# Altium schematic sheet OECU_BASE3.SchDoc
size A4; SheetNumber: 3; SheetTotal: 6
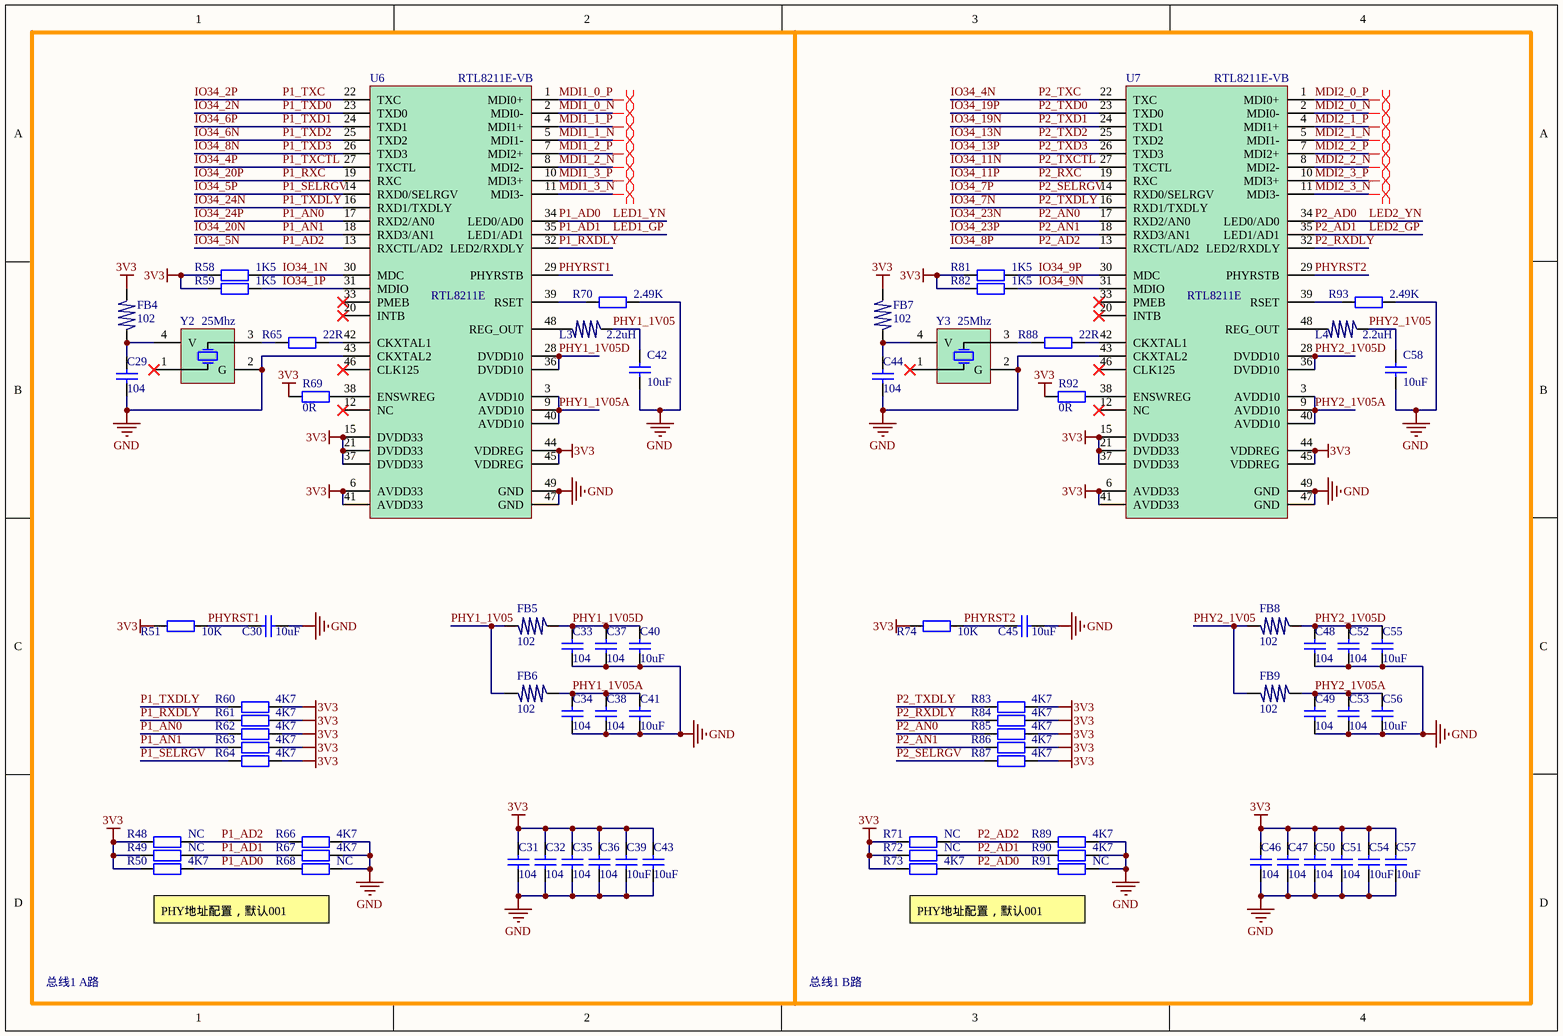
[diagram p0: OECU_BASE3.SchDoc]

## Parts
C29  104  [0402]
C30  10uF  [0402]
C31  104  [0402]
C32  104  [0402]
C33  104  [0402]
C34  104  [0402]
C35  104  [0402]
C36  104  [0402]
C37  104  [0402]
C38  104  [0402]
C39  10uF  [0402]
C40  10uF  [0402]
C41  10uF  [0402]
C42  10uF  [0402]
C43  10uF  [0402]
C44  104  [0402]
C45  10uF  [0402]
C46  104  [0402]
C47  104  [0402]
C48  104  [0402]
C49  104  [0402]
C50  104  [0402]
C51  104  [0402]
C52  104  [0402]
C53  104  [0402]
C54  10uF  [0402]
C55  10uF  [0402]
C56  10uF  [0402]
C57  10uF  [0402]
C58  10uF  [0402]
FB4  102  [0402]
FB5  102  [0603]
FB6  102  [0603]
FB7  102  [0402]
FB8  102  [0603]
FB9  102  [0603]
L3  2.2uH  [0805]
L4  2.2uH  [0805]
R48  NC  [R_0402]
R49  NC  [R_0402]
R50  4K7  [R_0402]
R51  10K  [R_0402]
R58  1K5  [R_0402]
R59  1K5  [R_0402]
R60  4K7  [R_0402]
R61  4K7  [R_0402]
R62  4K7  [R_0402]
R63  4K7  [R_0402]
R64  4K7  [R_0402]
R65  22R  [R_0402]
R66  4K7  [R_0402]
R67  4K7  [R_0402]
R68  NC  [R_0402]
R69  0R  [R_0402]
R70  2.49K  [R_0402]
R71  NC  [R_0402]
R72  NC  [R_0402]
R73  4K7  [R_0402]
R74  10K  [R_0402]
R81  1K5  [R_0402]
R82  1K5  [R_0402]
R83  4K7  [R_0402]
R84  4K7  [R_0402]
R85  4K7  [R_0402]
R86  4K7  [R_0402]
R87  4K7  [R_0402]
R88  22R  [R_0402]
R89  4K7  [R_0402]
R90  4K7  [R_0402]
R91  NC  [R_0402]
R92  0R  [R_0402]
R93  2.49K  [R_0402]
U6  RTL8211E-VB  [QFN48]
U7  RTL8211E-VB  [QFN48]
Y2  25Mhz  [XTAL_3225]
Y3  25Mhz  [XTAL_3225]

## Nets
3V3: C31.1 C32.1 C35.1 C36.1 C39.1 C43.1 C46.1 C47.1 C50.1 C51.1 C54.1 C57.1 FB4.2 FB7.2 R48.1 R49.1 R50.1 R51.1 R58.2 R59.2 R60.2 R61.2 R62.2 R63.2 R64.2 R69.2 R71.1 R72.1 R73.1 R74.1 R81.2 R82.2 R83.2 R84.2 R85.2 R86.2 R87.2 R92.2 U6.6(AVDD33) U6.15(DVDD33) U6.21(DVDD33) U6.37(DVDD33) U6.41(AVDD33) U6.44(VDDREG) U6.45(VDDREG) U7.6(AVDD33) U7.15(DVDD33) U7.21(DVDD33) U7.37(DVDD33) U7.41(AVDD33) U7.44(VDDREG) U7.45(VDDREG)
GND: C29.1 C30.2 C31.2 C32.2 C33.1 C34.1 C35.2 C36.2 C37.1 C38.1 C39.2 C40.1 C41.1 C42.1 C43.2 C44.1 C45.2 C46.2 C47.2 C48.1 C49.1 C50.2 C51.2 C52.1 C53.1 C54.2 C55.1 C56.1 C57.2 C58.1 R66.2 R67.2 R68.2 R70.2 R89.2 R90.2 R91.2 R93.2 U6.43(CKXTAL2) U6.47(GND) U6.49(GND) U7.43(CKXTAL2) U7.47(GND) U7.49(GND) Y2.2(G) Y3.2(G)
IO34_1N: R58.1 U6.30(MDC)
IO34_1P: R59.1 U6.31(MDIO)
IO34_2N: U6.23(TXD0)  [also labelled P1_TXD0]
IO34_2P: U6.22(TXC)  [also labelled P1_TXC]
IO34_4N: U7.22(TXC)  [also labelled P2_TXC]
IO34_4P: U6.27(TXCTL)  [also labelled P1_TXCTL]
IO34_5N: R48.2 R66.1 U6.13(RXCTL/AD2)  [also labelled P1_AD2]
IO34_5P: R64.1 U6.14(RXD0/SELRGV)  [also labelled P1_SELRGV]
IO34_6N: U6.25(TXD2)  [also labelled P1_TXD2]
IO34_6P: U6.24(TXD1)  [also labelled P1_TXD1]
IO34_7N: R83.1 U7.16(RXD1/TXDLY)  [also labelled P2_TXDLY]
IO34_7P: R87.1 U7.14(RXD0/SELRGV)  [also labelled P2_SELRGV]
IO34_8N: U6.26(TXD3)  [also labelled P1_TXD3]
IO34_8P: R71.2 R89.1 U7.13(RXCTL/AD2)  [also labelled P2_AD2]
IO34_9N: R82.1 U7.31(MDIO)
IO34_9P: R81.1 U7.30(MDC)
IO34_11N: U7.27(TXCTL)  [also labelled P2_TXCTL]
IO34_11P: U7.19(RXC)  [also labelled P2_RXC]
IO34_13N: U7.25(TXD2)  [also labelled P2_TXD2]
IO34_13P: U7.26(TXD3)  [also labelled P2_TXD3]
IO34_19N: U7.24(TXD1)  [also labelled P2_TXD1]
IO34_19P: U7.23(TXD0)  [also labelled P2_TXD0]
IO34_20N: R63.1 U6.18(RXD3/AN1)  [also labelled P1_AN1]
IO34_20P: U6.19(RXC)  [also labelled P1_RXC]
IO34_23N: R85.1 U7.17(RXD2/AN0)  [also labelled P2_AN0]
IO34_23P: R86.1 U7.18(RXD3/AN1)  [also labelled P2_AN1]
IO34_24N: R60.1 U6.16(RXD1/TXDLY)  [also labelled P1_TXDLY]
IO34_24P: R62.1 U6.17(RXD2/AN0)  [also labelled P1_AN0]
LED1_GP: R49.2 R67.1 U6.35(LED1/AD1)  [also labelled P1_AD1]
LED1_YN: R50.2 R68.1 U6.34(LED0/AD0)  [also labelled P1_AD0]
LED2_GP: R72.2 R90.1 U7.35(LED1/AD1)  [also labelled P2_AD1]
LED2_YN: R73.2 R91.1 U7.34(LED0/AD0)  [also labelled P2_AD0]
MDI1_0_N: U6.2(MDI0-)
MDI1_0_P: U6.1(MDI0+)
MDI1_1_N: U6.5(MDI1-)
MDI1_1_P: U6.4(MDI1+)
MDI1_2_N: U6.8(MDI2-)
MDI1_2_P: U6.7(MDI2+)
MDI1_3_N: U6.11(MDI3-)
MDI1_3_P: U6.10(MDI3+)
MDI2_0_N: U7.2(MDI0-)
MDI2_0_P: U7.1(MDI0+)
MDI2_1_N: U7.5(MDI1-)
MDI2_1_P: U7.4(MDI1+)
MDI2_2_N: U7.8(MDI2-)
MDI2_2_P: U7.7(MDI2+)
MDI2_3_N: U7.11(MDI3-)
MDI2_3_P: U7.10(MDI3+)
P1_RXDLY: R61.1 U6.32(LED2/RXDLY)
P2_RXDLY: R84.1 U7.32(LED2/RXDLY)
PHY1_1V05: C42.2 FB5.1 FB6.1 L3.1
PHY1_1V05A: C34.2 C38.2 C41.2 FB6.2 U6.3(AVDD10) U6.9(AVDD10) U6.40(AVDD10)
PHY1_1V05D: C33.2 C37.2 C40.2 FB5.2 U6.28(DVDD10) U6.36(DVDD10)
PHY2_1V05: C58.2 FB8.1 FB9.1 L4.1
PHY2_1V05A: C49.2 C53.2 C56.2 FB9.2 U7.3(AVDD10) U7.9(AVDD10) U7.40(AVDD10)
PHY2_1V05D: C48.2 C52.2 C55.2 FB8.2 U7.28(DVDD10) U7.36(DVDD10)
PHYRST1: C30.1 R51.2 U6.29(PHYRSTB)
PHYRST2: C45.1 R74.2 U7.29(PHYRSTB)
NetC29_2: C29.2 FB4.1 Y2.4(V)
NetC44_2: C44.2 FB7.1 Y3.4(V)
NetL3_2: L3.2 U6.48(REG_OUT)
NetL4_2: L4.2 U7.48(REG_OUT)
NetR65_1: R65.1 U6.42(CKXTAL1)
NetR65_2: R65.2 Y2.3(OP)
NetR69_1: R69.1 U6.38(ENSWREG)
NetR70_1: R70.1 U6.39(RSET)
NetR88_1: R88.1 U7.42(CKXTAL1)
NetR88_2: R88.2 Y3.3(OP)
NetR92_1: R92.1 U7.38(ENSWREG)
NetR93_1: R93.1 U7.39(RSET)

Not connected (* = marked no-connect by the designer): U6 12(NC)* 20(INTB)* 33(PMEB)* 46(CLK125)*; U7 12(NC)* 20(INTB)* 33(PMEB)* 46(CLK125)*; Y2 1(EC)*; Y3 1(EC)*

## Layout directives
differential pair: MDI1_0_N, MDI1_0_P, MDI1_1_N, MDI1_1_P, MDI1_2_N, MDI1_2_P, MDI1_3_N, MDI1_3_P, MDI2_0_N, MDI2_0_P, MDI2_1_N, MDI2_1_P, MDI2_2_N, MDI2_2_P, MDI2_3_N, MDI2_3_P

## Notes on the sheet
- PHY地址配置，默认001
- 总线1 A路
- 总线1 B路

## Library data of the parts
C29-C58 = CAP_0402: 贴片电容 0402
FB4 FB7 = FB_0402: 磁珠 0402
FB5 FB6 FB8 FB9 = FB_0603: 磁珠 0603
L3 L4 = L_0805: 电感 0805
R48-R51 R58-R74 R81-R93 = RES_0402: 电阻 0402
U6 U7 = RTL8211E: QFN48
Y2 Y3 = XTAL_3225